# Altium schematic sheet Thermocouple.SchDoc
size A4
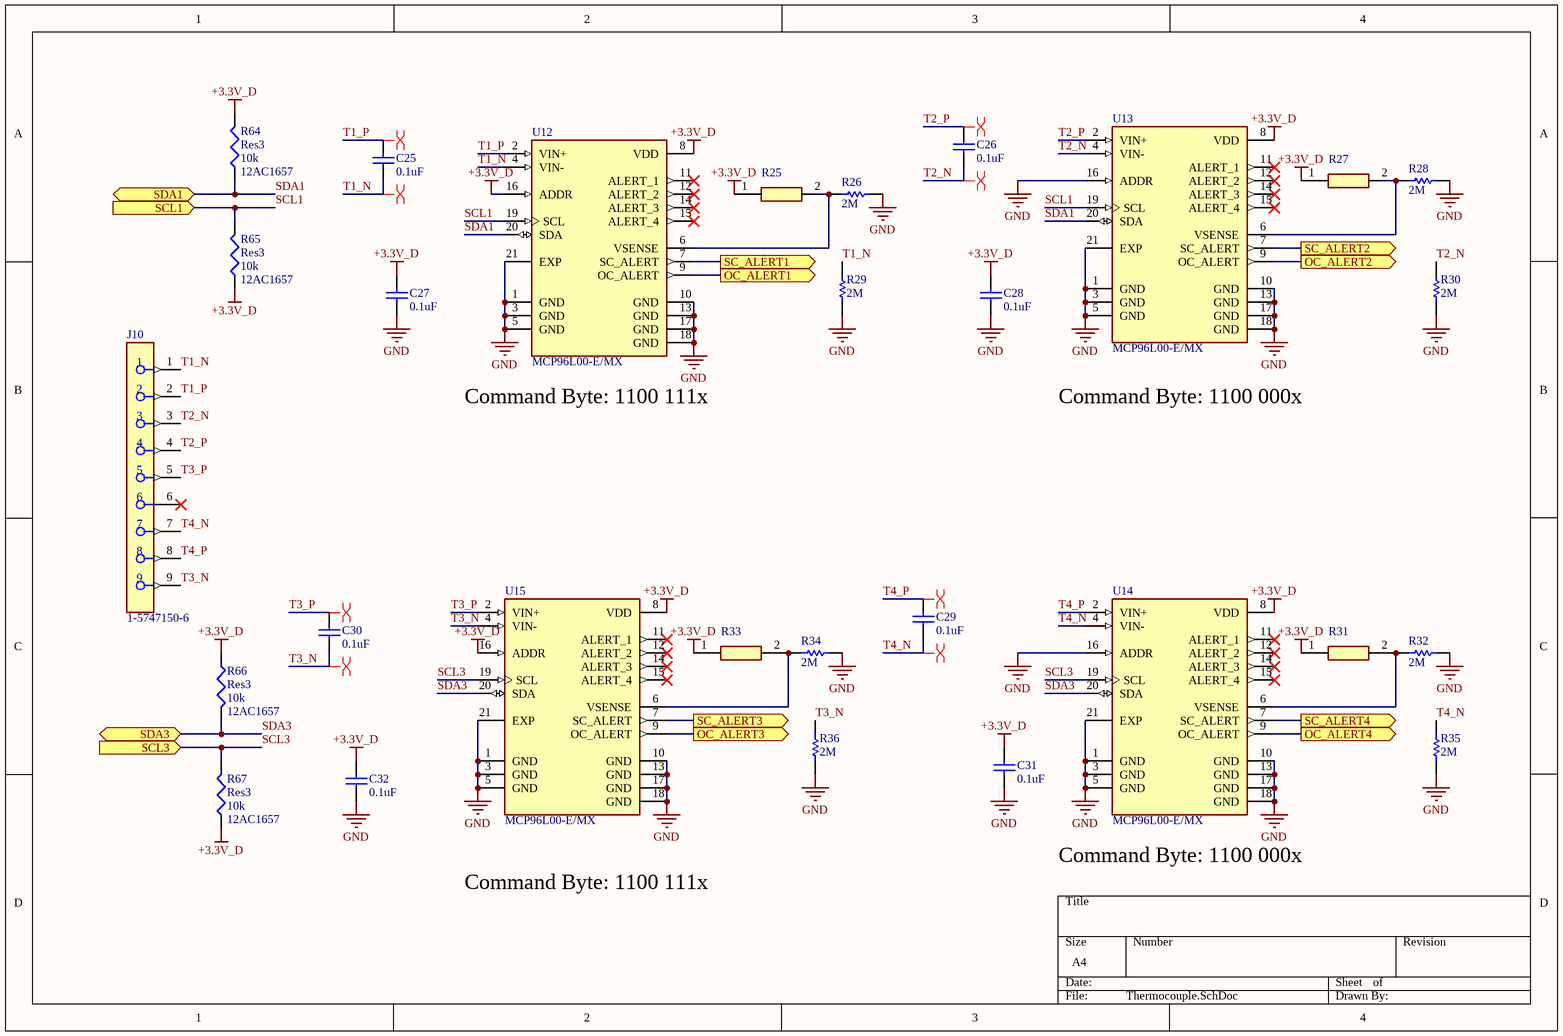
[diagram p0: Thermocouple.SchDoc]

## Parts
C25  0.1uF  [CAPC1608X90X35NL15T15]
C26  0.1uF  [CAPC1608X90X35NL15T15]
C27  0.1uF  [CAPC1608X90X35NL15T15]
C28  0.1uF  [CAPC1608X90X35NL15T15]
C29  0.1uF  [CAPC1608X90X35NL15T15]
C30  0.1uF  [CAPC1608X90X35NL15T15]
C31  0.1uF  [CAPC1608X90X35NL15T15]
C32  0.1uF  [CAPC1608X90X35NL15T15]
J10  1-5747150-6  [FP-1-5747150-6-MFG]
R25  ERJ-U02F1004X  [ERJS02_U02_(0402)]  (value not drawn)
R26  Resistance: 2M  [RESC1005X40X25LL05T05]  (hidden comment: ERJ-2GEJ205X)
R27  ERJ-U02F1004X  [ERJS02_U02_(0402)]  (value not drawn)
R28  Resistance: 2M  [RESC1005X40X25LL05T05]  (hidden comment: ERJ-2GEJ205X)
R29  Resistance: 2M  [RESC1005X40X25LL05T05]  (hidden comment: ERJ-2GEJ205X)
R30  Resistance: 2M  [RESC1005X40X25LL05T05]  (hidden comment: ERJ-2GEJ205X)
R31  ERJ-U02F1004X  [ERJS02_U02_(0402)]  (value not drawn)
R32  Resistance: 2M  [RESC1005X40X25LL05T05]  (hidden comment: ERJ-2GEJ205X)
R33  ERJ-U02F1004X  [ERJS02_U02_(0402)]  (value not drawn)
R34  Resistance: 2M  [RESC1005X40X25LL05T05]  (hidden comment: ERJ-2GEJ205X)
R35  Resistance: 2M  [RESC1005X40X25LL05T05]  (hidden comment: ERJ-2GEJ205X)
R36  Resistance: 2M  [RESC1005X40X25LL05T05]  (hidden comment: ERJ-2GEJ205X)
R64  Res3  value 10k  Supplier Part Number 1: 12AC1657  [6-0805_L]
R65  Res3  value 10k  Supplier Part Number 1: 12AC1657  [6-0805_L]
R66  Res3  value 10k  Supplier Part Number 1: 12AC1657  [6-0805_L]
R67  Res3  value 10k  Supplier Part Number 1: 12AC1657  [6-0805_L]
U12  MCP96L00-E/MX  [QFN65P500X500X100-21N_MCP9600-E/MX]
U13  MCP96L00-E/MX  [QFN65P500X500X100-21N_MCP9600-E/MX]
U14  MCP96L00-E/MX  [QFN65P500X500X100-21N_MCP9600-E/MX]
U15  MCP96L00-E/MX  [QFN65P500X500X100-21N_MCP9600-E/MX]

## Ports
OC_ALERT1 (out), OC_ALERT2 (out), OC_ALERT3 (out), OC_ALERT4 (out), SC_ALERT1 (out), SC_ALERT2 (out), SC_ALERT3 (out), SC_ALERT4 (out), SCL1 (in), SCL3 (in), SDA1 (bidir), SDA3 (bidir)

## Nets
+3.3V_D: C27.2 C28.2 C31.2 C32.2 R25.1 R27.1 R31.1 R33.1 R64.2 R65.1 R66.1 R67.1 U12.8(VDD) U12.16(ADDR) U13.8(VDD) U14.8(VDD) U15.8(VDD) U15.16(ADDR)
GND: C27.1 C28.1 C31.1 C32.1 R26.2 R28.2 R29.1 R30.1 R32.2 R34.2 R35.1 R36.1 U12.1(GND) U12.3(GND) U12.5(GND) U12.10(GND) U12.13(GND) U12.17(GND) U12.18(GND) U12.21(EXP) U13.1(GND) U13.3(GND) U13.5(GND) U13.10(GND) U13.13(GND) U13.16(ADDR) U13.17(GND) U13.18(GND) U13.21(EXP) U14.1(GND) U14.3(GND) U14.5(GND) U14.10(GND) U14.13(GND) U14.16(ADDR) U14.17(GND) U14.18(GND) U14.21(EXP) U15.1(GND) U15.3(GND) U15.5(GND) U15.10(GND) U15.13(GND) U15.17(GND) U15.18(GND) U15.21(EXP)
OC_ALERT1: U12.9(OC_ALERT) ; port OC_ALERT1
OC_ALERT2: U13.9(OC_ALERT) ; port OC_ALERT2
OC_ALERT3: U15.9(OC_ALERT) ; port OC_ALERT3
OC_ALERT4: U14.9(OC_ALERT) ; port OC_ALERT4
SC_ALERT1: U12.7(SC_ALERT) ; port SC_ALERT1
SC_ALERT2: U13.7(SC_ALERT) ; port SC_ALERT2
SC_ALERT3: U15.7(SC_ALERT) ; port SC_ALERT3
SC_ALERT4: U14.7(SC_ALERT) ; port SC_ALERT4
SCL1: R65.2 U12.19(SCL) U13.19(SCL) ; port SCL1
SCL3: R67.2 U14.19(SCL) U15.19(SCL) ; port SCL3
SDA1: R64.1 U12.20(SDA) U13.20(SDA) ; port SDA1
SDA3: R66.2 U14.20(SDA) U15.20(SDA) ; port SDA3
T1_N: C25.1 J10.1 R29.2 U12.4(VIN-)
T1_P: C25.2 J10.2 U12.2(VIN+)
T2_N: C26.1 J10.3 R30.2 U13.4(VIN-)
T2_P: C26.2 J10.4 U13.2(VIN+)
T3_N: C30.1 J10.9 R36.2 U15.4(VIN-)
T3_P: C30.2 J10.5 U15.2(VIN+)
T4_N: C29.1 J10.7 R35.2 U14.4(VIN-)
T4_P: C29.2 J10.8 U14.2(VIN+)
NetR25_2: R25.2 R26.1 U12.6(VSENSE)
NetR27_2: R27.2 R28.1 U13.6(VSENSE)
NetR31_2: R31.2 R32.1 U14.6(VSENSE)
NetR33_2: R33.2 R34.1 U15.6(VSENSE)

Not connected (* = marked no-connect by the designer): J10 6*; U12 11(ALERT_1)* 12(ALERT_2)* 14(ALERT_3)* 15(ALERT_4)*; U13 11(ALERT_1)* 12(ALERT_2)* 14(ALERT_3)* 15(ALERT_4)*; U14 11(ALERT_1)* 12(ALERT_2)* 14(ALERT_3)* 15(ALERT_4)*; U15 11(ALERT_1)* 12(ALERT_2)* 14(ALERT_3)* 15(ALERT_4)*

## Layout directives
differential pair: T1_N, T1_P, T2_N, T2_P, T3_N, T3_P, T4_N, T4_P

## Notes on the sheet
- (near U12) Command Byte: 1100 111x
- Command Byte: 1100 000x
- Command Byte: 1100 111x
- (near U14) Command Byte: 1100 000x

## Library data of the parts
C25-C32 = CMP-2006-04489-1: Part Number: 0603YC104JAT2A; Manufacturer: AVX Interconnect / Elco
J10 = CMP-03367-000009-1: CONN D-SUB RCPT 9POS VERT SOLDER; Manufacturer: TE Connectivity; Is Female: yes; Current Rating: 6A; Conn Orientation: Vertical; Conn Gender: Female; Shielding: false; Number Of Contacts: 9; Pitch: 2.74mm; ComponentLink2URL: https://www.te.com/usa-en/product-1-5747150-6.html?te_bu=Cor&te_type=other&te_campaign=oct_glo_cor-oct-global-oth-prtnr-fy19-oct-octo-buy-bom_sma-298_2&elqCampaignId=35216; Manufacturer Part Number: 1-5747150-6; Temperature: -55°C to +105°C; Mouser Description: D-Sub Standard Connectors RECP FRNT MTL SHL 9P female screwlocks; Octopart: https://octopart.com/1-5747150-6-te+connectivity-39500344; Category: Conn; Automotive: No; Package: 1-5747150-6; Device Class L3: unset; Contact Material: Gold,Nickel; Lead Free: Yes; Height: 12.54mm; RoHS: TRUE; ComponentLink2Description: Datasheet; Device Class L2: D-Sub Connectors; Device Class L1: Connectors; Digikey Description: CONN D-SUB RCPT 9POS VERT SOLDER; Temperature Range High: +105°C; Temperature Range Low: -55°C
R25 R27 R31 R33 = ERJ-U02F1004X: Resistor; Manufacturer_Name: Panasonic; Datasheet Link: https://industrial.panasonic.com/cdbs/www-data/pdf/RDP0000/AOA0000C334.pdf; Height: 0.4mm; Manufacturer_Part_Number: ERJ-U02F1004X
R26 R28-R30 R32 R34-R36 = CMP-1011-00153-2: Manufacturer: Panasonic; Part Number: ERJ-2GEJ205X
R64-R67 = Res3: VISHAY BC COMPONENTS   MCT06030C1002FP500   RESISTOR, 0603, 10KOHM, 100mW, 1PER; SPN: RNCP0805FTD10K0CT-ND; Resistance: 10kR; Tolerance: 1%; Temperature Coefficient: 50ppm/°C; Voltage Rating: 75V; Max Power Dissipation: 125mW; Published: 8-Jun-2000; LatestRevisionDate: 29-May-2009; LatestRevisionNote: IPC-7351 Footprint Added.; PackageReference: J1-0603; Publisher: Altium Limited; PackageDescription: Chip Resistor; Supplier 1: Newark; Manufacturer: Vishay; Manufacturer Part Number: MCT06030C1002FP500; RoHS: Yes; Category: Chip SMD Resistors; Stock 1: 224988; Pricing 1: 1=0.02000, 5000=0.01900, 10000=0.01800, 20000=0.01700, 30000=0.01600 (USD); Mount: Surface Mount; Case/Package: 0603; Case Code (Imperial): 0603; Case Code (Metric): 1608; Contact Plating: Tin; Min Operating Temperature: -55°C; Max Operating Temperature: 125°C; Packaging: Tape and Reel; Composition: Thin Film; Power Rating: 100mW; Number of Terminations: 2; Military Standard: Not; Package Quantity: 1; Voltage Rating (DC): 75V; Length: 1.55mm; Height: 0.022inch; Width: 0.8mm; Depth: 0.85mm; Radiation Hardening: No; Lead Free: Lead Free; REACH SVHC: Unknown; ComponentLink1URL: https://datasheet.ciiva.com/7836/mc-pro-7836231.pdf?src-supplier=Element14; ComponentLink1Description: https://datasheet.ciiva.com/7836/mc-pro-7836231.pdf?src-supplier=Element14; ComponentLink2URL: https://datasheet.ciiva.com/2470/mc-pro-2470393.pdf?src-supplier=Digi-Key; ComponentLink2Description: https://datasheet.ciiva.com/2470/mc-pro-2470393.pdf?src-supplier=Digi-Key; ComponentLink3URL: https://datasheet.ciiva.com/48524/mc-pro-48524219.pdf?src-supplier=Avnet; ComponentLink3Description: https://datasheet.ciiva.com/48524/mc-pro-48524219.pdf?src-supplier=Avnet; ComponentLink4URL: https://datasheet.ciiva.com/16452/mc-pro-16452734.pdf?src-supplier=Future+Electronics; ComponentLink4Description: https://datasheet.ciiva.com/16452/mc-pro-16452734.pdf?src-supplier=Future+Electronics; ComponentLink5URL: https://datasheet.ciiva.com/22734/mc-pro-22734095.pdf?src-supplier=Element14; ComponentLink5Description: https://datasheet.ciiva.com/22734/mc-pro-22734095.pdf?src-supplier=Element14; ComponentLink6URL: https://datasheet.ciiva.com/2470/mc-pro-2470394.pdf?src-supplier=Digi-Key; ComponentLink6Description: https://datasheet.ciiva.com/2470/mc-pro-2470394.pdf?src-supplier=Digi-Key; ComponentLink7URL: https://datasheet.ciiva.com/2470/mc-pro-2470395.pdf?src-supplier=Digi-Key; ComponentLink7Description: https://datasheet.ciiva.com/2470/mc-pro-2470395.pdf?src-supplier=Digi-Key; ComponentLink8URL: https://datasheet.ciiva.com/5897/mc-pro-5897803.pdf?src-supplier=Farnell; ComponentLink8Description: https://datasheet.ciiva.com/5897/mc-pro-5897803.pdf?src-supplier=Farnell; ComponentLink9URL: https://datasheet.ciiva.com/16512/mc-pro-16512780.pdf?src-supplier=Avnet+Asia; ComponentLink9Description: https://datasheet.ciiva.com/16512/mc-pro-16512780.pdf?src-supplier=Avnet+Asia; ComponentLink10URL: https://datasheet.ciiva.com/16892/mc-pro-16892989.pdf?src-supplier=Avnet+Europe; ComponentLink10Description: https://datasheet.ciiva.com/16892/mc-pro-16892989.pdf?src-supplier=Avnet+Europe; ComponentLink11URL: https://datasheet.ciiva.com/9112/mc-pro-9112527.pdf?src-supplier=Avnet; ComponentLink11Description: https://datasheet.ciiva.com/9112/mc-pro-9112527.pdf?src-supplier=Avnet
U12-U15 = MCP96001-E/MX: IC THERMOCOUPLE TO I2C 20MQFN; MF: Microchip; Package: VQFN-20 Microchip; MP: MCP96L00-E/MX; Value: *; Availability: Unavailable; SnapEDA_Link: https://www.snapeda.com/parts/MCP9600-E/MX/Microchip/view-part/553302/?ref=snap; Price: None